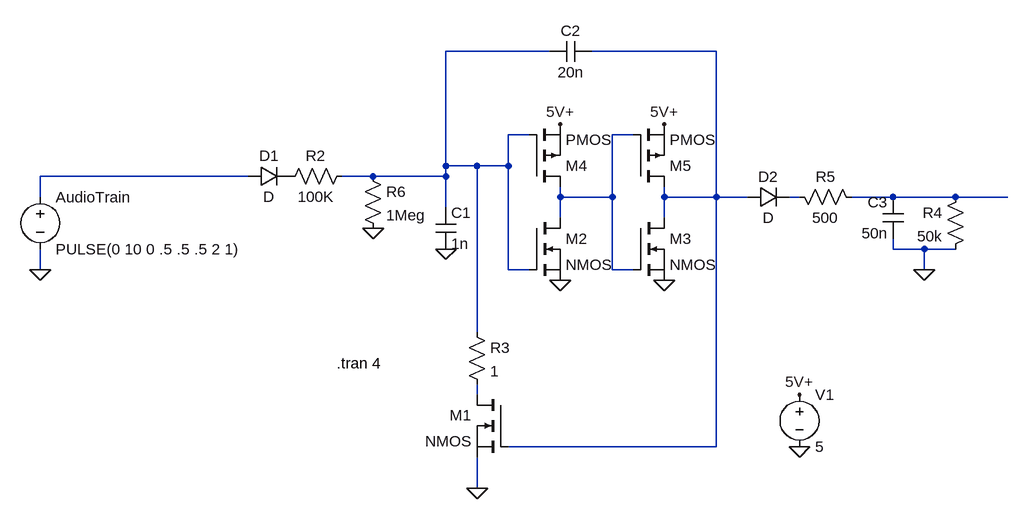
[diagram p0: schematic Neuron_Ramp.asc]
Neuron_Ramp.asc, the LTspice schematic file:
Version 4
SHEET 1 5076 1812
WIRE 560 -256 400 -256
WIRE 816 -256 624 -256
WIRE 528 -128 496 -128
WIRE 688 -128 656 -128
WIRE 400 -80 400 -256
WIRE 448 -80 400 -80
WIRE 496 -80 496 -128
WIRE 496 -80 448 -80
WIRE 96 -64 -224 -64
WIRE 288 -64 240 -64
WIRE 400 -64 400 -80
WIRE 400 -64 288 -64
WIRE -224 -32 -224 -64
WIRE 576 -32 576 -48
WIRE 656 -32 656 -128
WIRE 656 -32 576 -32
WIRE 736 -32 736 -48
WIRE 816 -32 816 -256
WIRE 816 -32 736 -32
WIRE 864 -32 816 -32
WIRE 944 -32 928 -32
WIRE 1088 -32 1024 -32
WIRE 1184 -32 1088 -32
WIRE 1264 -32 1184 -32
WIRE 400 -16 400 -64
WIRE 576 0 576 -32
WIRE 736 0 736 -32
WIRE 1088 48 1088 32
WIRE 1136 48 1088 48
WIRE 1184 48 1136 48
WIRE -224 80 -224 48
WIRE 496 80 496 -80
WIRE 528 80 496 80
WIRE 656 80 656 -32
WIRE 688 80 656 80
WIRE 1136 80 1136 48
WIRE 448 176 448 -80
WIRE 448 272 448 256
WIRE 816 352 816 -32
WIRE 816 352 496 352
WIRE 448 416 448 368
FLAG -224 80 0
FLAG 944 352 0
FLAG 944 272 5V+
FLAG 400 48 0
FLAG 576 -144 5V+
FLAG 736 -144 5V+
FLAG 736 96 0
FLAG 576 96 0
FLAG 448 416 0
FLAG 1136 80 0
FLAG 288 16 0
SYMBOL voltage -224 -48 R0
WINDOW 123 0 0 Left 0
WINDOW 39 0 0 Left 0
SYMATTR InstName AudioTrain
SYMATTR Value PULSE(0 10 0 .5 .5 .5 2 1)
SYMBOL res 256 -80 R90
WINDOW 0 0 56 VBottom 2
WINDOW 3 32 56 VTop 2
SYMATTR InstName R2
SYMATTR Value 100K
SYMBOL cap 384 -16 R0
SYMATTR InstName C1
SYMATTR Value 1n
SYMBOL cap 624 -272 R90
WINDOW 0 0 32 VBottom 2
WINDOW 3 32 32 VTop 2
SYMATTR InstName C2
SYMATTR Value 20n
SYMBOL voltage 944 256 R0
WINDOW 123 0 0 Left 2
WINDOW 39 0 0 Left 2
SYMATTR InstName V1
SYMATTR Value 5
SYMBOL nmos 496 272 M0
SYMATTR InstName M1
SYMBOL nmos 528 0 R0
SYMATTR InstName M2
SYMBOL nmos 688 0 R0
SYMATTR InstName M3
SYMBOL pmos 528 -48 M180
SYMATTR InstName M4
SYMBOL pmos 688 -48 M180
SYMATTR InstName M5
SYMBOL diode 96 -48 R270
WINDOW 0 32 32 VTop 2
WINDOW 3 0 32 VBottom 2
SYMATTR InstName D1
SYMBOL res 432 160 R0
SYMATTR InstName R3
SYMATTR Value 1
SYMBOL res 1200 -48 M0
SYMATTR InstName R4
SYMATTR Value 50k
SYMBOL cap 1104 -32 M0
SYMATTR InstName C3
SYMATTR Value 50n
SYMBOL res 928 -48 M90
WINDOW 0 0 56 VBottom 2
WINDOW 3 32 56 VTop 2
SYMATTR InstName R5
SYMATTR Value 500
SYMBOL diode 864 -16 R270
WINDOW 0 32 32 VTop 2
WINDOW 3 0 32 VBottom 2
SYMATTR InstName D2
SYMBOL res 272 -80 R0
SYMATTR InstName R6
SYMATTR Value 1Meg
TEXT 232 224 Left 2 !.tran 4

The netlist it stands for:
* Neuron_Ramp.asc
V§AudioTrain N004 0 PULSE(0 10 0 .5 .5 .5 2 1)
R2 N001 P001 100K
C1 N001 0 1n
C2 N002 N001 20n
V1 5V+ 0 5
M1 N007 N002 0 0 NMOS
M2 N003 N001 0 0 NMOS
M3 N002 N003 0 0 NMOS
M4 N003 N001 5V+ 5V+ PMOS
M5 N002 N003 5V+ 5V+ PMOS
D1 N004 P001 D
R3 N001 N007 1
R4 N006 0 50k
C3 N006 0 50n
R5 N005 N006 500
D2 N002 N005 D
R6 N001 0 1Meg
.model D D
.lib standard.dio
.model NMOS NMOS
.model PMOS PMOS
.lib standard.mos
.tran 4
.backanno
.end